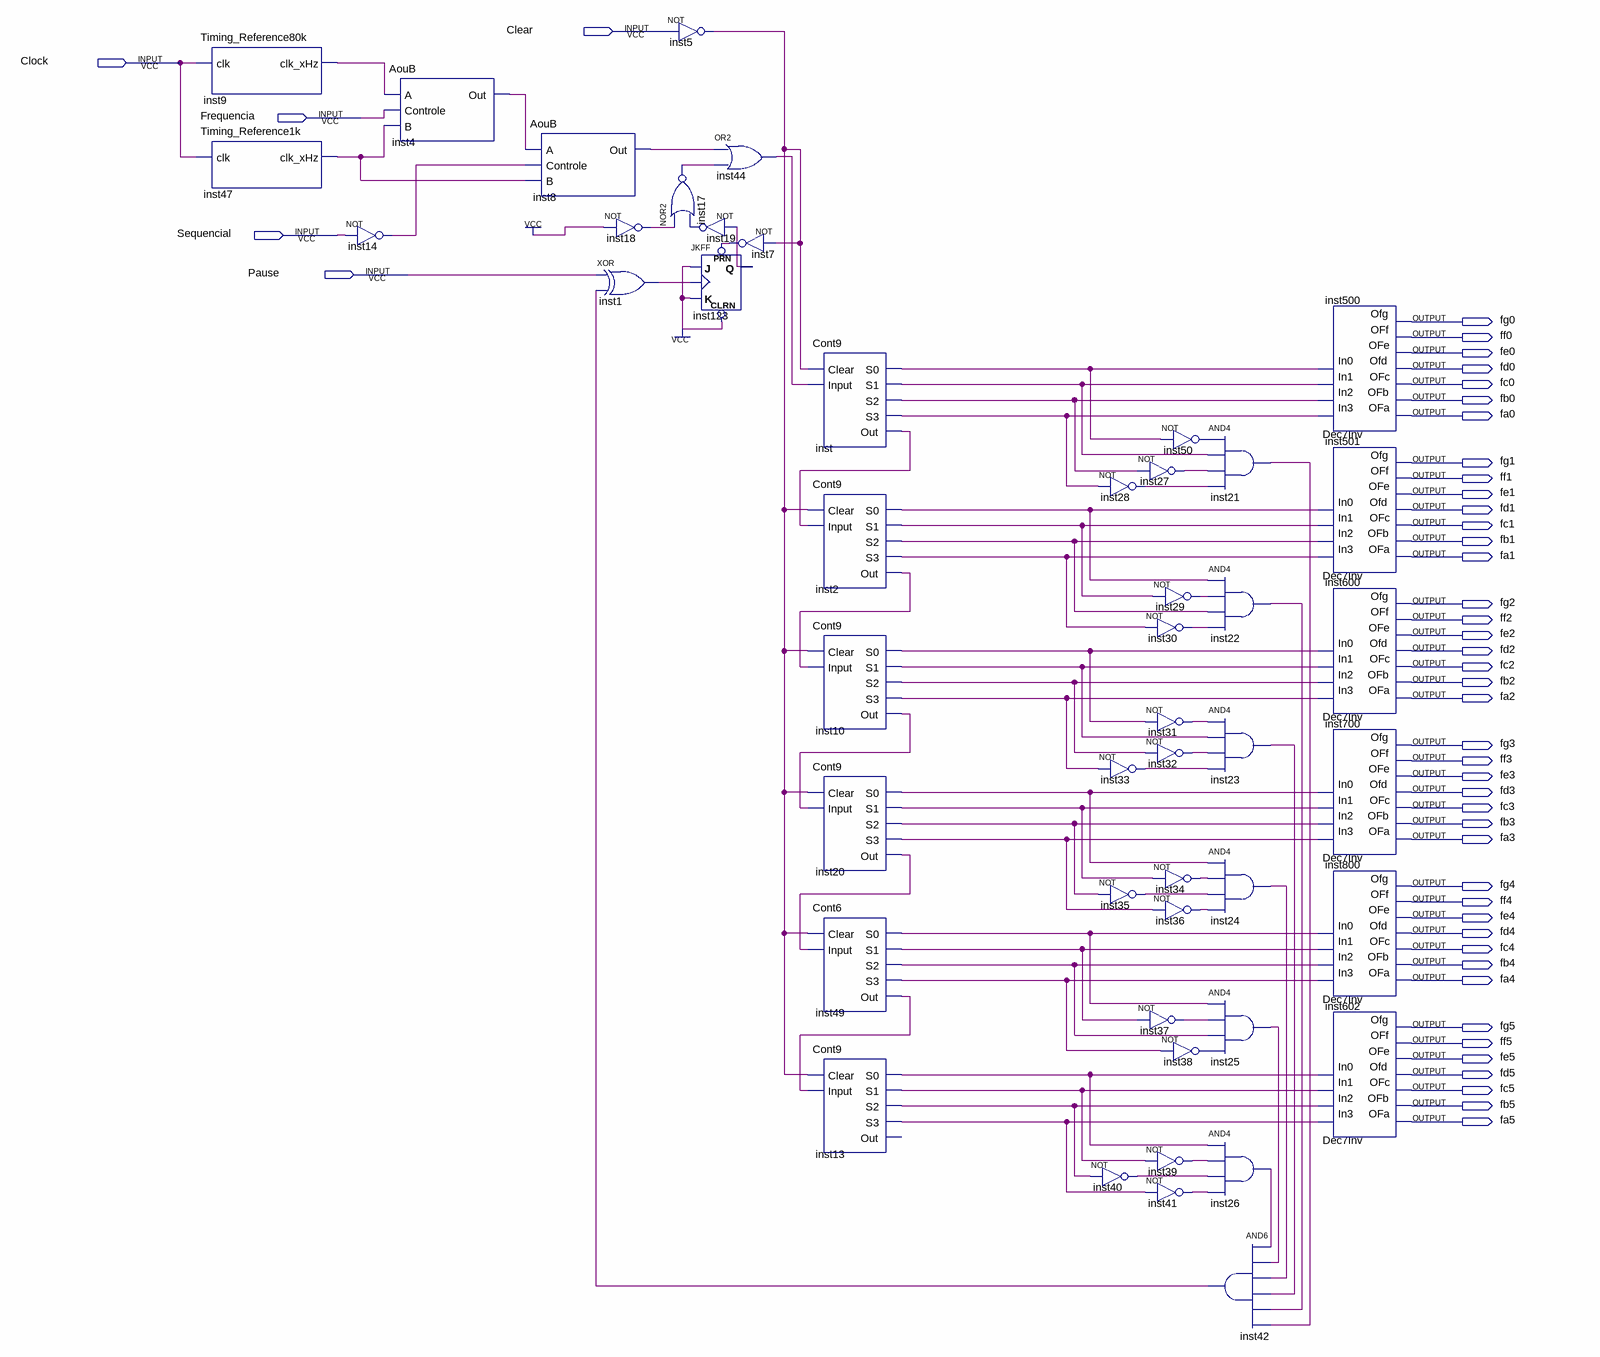
[diagram p0: schematic sheet]
// Quartus schematic Lab5.bdf as structural Verilog: 48 symbols, 47 pins
module Lab5 (
  input  Clear,
  input  Clock,
  input  Frequencia,
  input  Sequencial,
  input  Pause,
  output fg0,
  output ff0,
  output fe0,
  output fd0,
  output fc0,
  output fb0,
  output fa0,
  output fg1,
  output ff1,
  output fe1,
  output fd1,
  output fc1,
  output fb1,
  output fa1,
  output fg2,
  output ff2,
  output fe2,
  output fd2,
  output fc2,
  output fb2,
  output fa2,
  output fg3,
  output ff3,
  output fe3,
  output fd3,
  output fc3,
  output fb3,
  output fa3,
  output fg4,
  output ff4,
  output fe4,
  output fd4,
  output fc4,
  output fb4,
  output fa4,
  output fg5,
  output ff5,
  output fe5,
  output fd5,
  output fc5,
  output fb5,
  output fa5
);

  wire inst1_out, inst2_out, inst2_s0, inst2_s1, inst2_s2, inst2_s3, inst4_out, inst5_out, inst7_out,
       inst8_out, inst9_clk_xhz, inst10_out, inst10_s0, inst10_s1, inst10_s2, inst10_s3, inst13_s0,
       inst13_s1, inst13_s2, inst13_s3, inst14_out, inst17_out, inst18_out, inst19_out, inst20_out,
       inst20_s0, inst20_s1, inst20_s2, inst20_s3, inst21_out, inst22_out, inst23_out, inst24_out,
       inst25_out, inst26_out, inst27_out, inst28_out, inst29_out, inst30_out, inst31_out, inst32_out,
       inst33_out, inst34_out, inst35_out, inst36_out, inst37_out, inst38_out, inst39_out, inst40_out,
       inst41_out, inst42_out, inst44_out, inst47_clk_xhz, inst49_out, inst49_s0, inst49_s1, inst49_s2,
       inst49_s3, inst50_out, inst123_q, inst_out, inst_s0, inst_s1, inst_s2, inst_s3;

  Timing_Reference80k inst9 (.clk(Clock), .clk_xHz(inst9_clk_xhz));
  Timing_Reference1k inst47 (.clk(Clock), .clk_xHz(inst47_clk_xhz));
  AouB inst4 (.A(inst9_clk_xhz), .Controle(Frequencia), .B(inst47_clk_xhz), .Out(inst4_out));
  not inst14 (inst14_out, Sequencial);
  AouB inst8 (.A(inst4_out), .Controle(inst14_out), .B(inst47_clk_xhz), .Out(inst8_out));
  not inst18 (inst18_out, 1'b1);
  xor inst1 (inst1_out, Pause, inst42_out);
  not inst5 (inst5_out, Clear);
  nor inst17 (inst17_out, inst18_out, inst19_out);
  not inst19 (inst19_out, inst123_q);
  JKFF inst123 (.PRN(inst7_out), .CLRN(1'b1), .K(1'b1), .J(1'b1), .CLK(inst1_out), .Q(inst123_q));
  or inst44 (inst44_out, inst8_out, inst17_out);
  not inst7 (inst7_out, inst5_out);
  Cont9 inst (
    .Clear(inst5_out), .Input(inst44_out), .S0(inst_s0), .S1(inst_s1), .S2(inst_s2), .S3(inst_s3),
    .Out(inst_out));
  Cont9 inst2 (
    .Clear(inst5_out), .Input(inst_out), .S0(inst2_s0), .S1(inst2_s1), .S2(inst2_s2), .S3(inst2_s3),
    .Out(inst2_out));
  Cont9 inst10 (
    .Clear(inst5_out), .Input(inst2_out), .S0(inst10_s0), .S1(inst10_s1), .S2(inst10_s2), .S3(inst10_s3),
    .Out(inst10_out));
  Cont9 inst20 (
    .Clear(inst5_out), .Input(inst10_out), .S0(inst20_s0), .S1(inst20_s1), .S2(inst20_s2), .S3(inst20_s3),
    .Out(inst20_out));
  Cont6 inst49 (
    .Clear(inst5_out), .Input(inst20_out), .S0(inst49_s0), .S1(inst49_s1), .S2(inst49_s2), .S3(inst49_s3),
    .Out(inst49_out));
  Cont9 inst13 (
    .Clear(inst5_out), .Input(inst49_out), .S0(inst13_s0), .S1(inst13_s1), .S2(inst13_s2), .S3(inst13_s3));  // open: Out
  not inst27 (inst27_out, inst_s2);
  not inst28 (inst28_out, inst_s3);
  not inst33 (inst33_out, inst10_s3);
  not inst35 (inst35_out, inst20_s2);
  not inst37 (inst37_out, inst49_s1);
  not inst40 (inst40_out, inst13_s2);
  not inst50 (inst50_out, inst_s0);
  not inst29 (inst29_out, inst2_s1);
  not inst30 (inst30_out, inst2_s3);
  not inst31 (inst31_out, inst10_s0);
  not inst32 (inst32_out, inst10_s2);
  not inst34 (inst34_out, inst20_s1);
  not inst36 (inst36_out, inst20_s3);
  not inst38 (inst38_out, inst49_s3);
  not inst39 (inst39_out, inst13_s1);
  not inst41 (inst41_out, inst13_s3);
  and inst21 (inst21_out, inst50_out, inst_s1, inst27_out, inst28_out);
  and inst22 (inst22_out, inst2_s0, inst29_out, inst2_s2, inst30_out);
  and inst23 (inst23_out, inst31_out, inst10_s1, inst32_out, inst33_out);
  and inst24 (inst24_out, inst20_s0, inst34_out, inst35_out, inst36_out);
  and inst25 (inst25_out, inst49_s0, inst37_out, inst49_s2, inst38_out);
  and inst26 (inst26_out, inst13_s0, inst39_out, inst40_out, inst41_out);
  and inst42 (inst42_out, inst26_out, inst25_out, inst24_out, inst23_out, inst22_out, inst21_out);
  Dec7Inv inst500 (
    .In3(inst_s3), .In2(inst_s2), .In1(inst_s1), .In0(inst_s0), .OFa(fa0), .OFb(fb0), .OFc(fc0), .Ofd(fd0),
    .OFe(fe0), .OFf(ff0), .Ofg(fg0));
  Dec7Inv inst501 (
    .In3(inst2_s3), .In2(inst2_s2), .In1(inst2_s1), .In0(inst2_s0), .OFa(fa1), .OFb(fb1), .OFc(fc1),
    .Ofd(fd1), .OFe(fe1), .OFf(ff1), .Ofg(fg1));
  Dec7Inv inst600 (
    .In3(inst10_s3), .In2(inst10_s2), .In1(inst10_s1), .In0(inst10_s0), .OFa(fa2), .OFb(fb2), .OFc(fc2),
    .Ofd(fd2), .OFe(fe2), .OFf(ff2), .Ofg(fg2));
  Dec7Inv inst700 (
    .In3(inst20_s3), .In2(inst20_s2), .In1(inst20_s1), .In0(inst20_s0), .OFa(fa3), .OFb(fb3), .OFc(fc3),
    .Ofd(fd3), .OFe(fe3), .OFf(ff3), .Ofg(fg3));
  Dec7Inv inst800 (
    .In3(inst49_s3), .In2(inst49_s2), .In1(inst49_s1), .In0(inst49_s0), .OFa(fa4), .OFb(fb4), .OFc(fc4),
    .Ofd(fd4), .OFe(fe4), .OFf(ff4), .Ofg(fg4));
  Dec7Inv inst602 (
    .In3(inst13_s3), .In2(inst13_s2), .In1(inst13_s1), .In0(inst13_s0), .OFa(fa5), .OFb(fb5), .OFc(fc5),
    .Ofd(fd5), .OFe(fe5), .OFf(ff5), .Ofg(fg5));
endmodule
